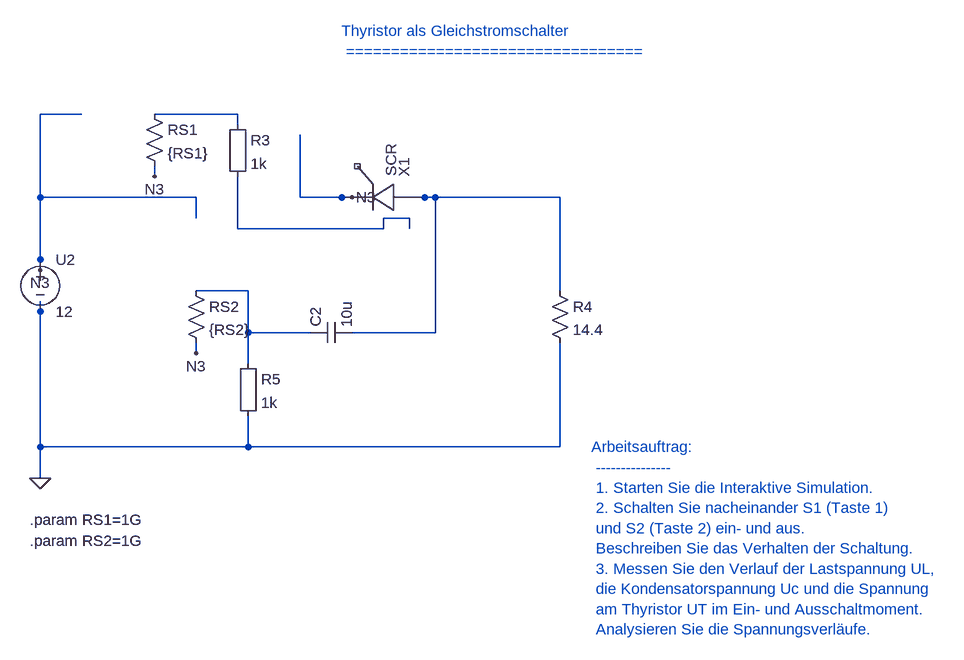
[diagram p0: schematic 11_1_2_Thyristor_als_Gleichstromschalter_2.asc]
11_1_2_Thyristor_als_Gleichstromschalter_2.asc, the LTspice schematic file:
Version 4
SHEET 1 880 680
WIRE 80 464 80 448
WIRE 880 512 880 528
WIRE 560 496 576 496
WIRE 648 336 648 320
WIRE 648 320 608 320
WIRE 672 288 640 288
WIRE 80 720 80 672
WIRE 80 672 80 448
WIRE 80 384 80 288
WIRE 80 288 320 288
WIRE 144 160 80 160
WIRE 80 160 80 288
WIRE 256 160 384 160
WIRE 384 160 384 176
WIRE 320 320 320 288
WIRE 880 528 880 672
WIRE 880 672 400 672
WIRE 496 496 400 496
WIRE 400 672 80 672
WIRE 400 624 400 672
WIRE 400 496 400 544
WIRE 320 432 400 432
WIRE 400 432 400 496
WIRE 880 432 880 288
WIRE 880 288 688 288
WIRE 688 288 688 496
WIRE 688 496 576 496
WIRE 640 288 688 288
WIRE 480 288 480 192
WIRE 544 288 480 288
WIRE 384 256 384 336
WIRE 384 336 608 336
WIRE 608 336 608 320
WIRE 320 512 320 528
WIRE 80 384 80 400
WIRE 256 240 256 256
WIRE 544 288 560 288
FLAG 80 720 0
FLAG 320 528 N3
FLAG 80 400 N3
FLAG 256 256 N3
FLAG 560 288 N3
SYMBOL voltage 80 368 R0
SYMATTR InstName U2
SYMATTR Value 12
SYMBOL Misc\EuropeanResistor 368 160 R0
SYMATTR InstName R3
SYMATTR Value 1k
SYMBOL res 240 144 R0
SYMATTR InstName RS1
SYMATTR Value {RS1}
SYMBOL res 864 416 R0
SYMATTR InstName R4
SYMATTR Value 14.4
SYMBOL Misc\EuropeanResistor 384 528 R0
SYMATTR InstName R5
SYMATTR Value 1k
SYMBOL res 304 416 R0
SYMATTR InstName RS2
SYMATTR Value {RS2}
SYMBOL cap 496 512 R270
SYMATTR InstName C2
SYMATTR Value 10u
SYMBOL SCR 608 288 M270
SYMATTR InstName X1
SYMATTR Prefix X
SYMATTR SpiceModel SCR
TEXT 64 784 Left 2 !.param RS1=1G
TEXT 64 816 Left 2 !.param RS2=1G
TEXT 544 32 Left 2 ;Thyristor als Gleichstromschalter \n =================================
TEXT 928 672 Left 2 ;Arbeitsauftrag: \n --------------- \n 1. Starten Sie die Interaktive Simulation. \n 2. Schalten Sie nacheinander S1 (Taste 1) \n und S2 (Taste 2) ein- und aus. \n Beschreiben Sie das Verhalten der Schaltung. \n 3. Messen Sie den Verlauf der Lastspannung UL, \n die Kondensatorspannung Uc und die Spannung \n am Thyristor UT im Ein- und Ausschaltmoment. \n Analysieren Sie die Spannungsverläufe.

The netlist it stands for:
* 11_1_2_Thyristor_als_Gleichstromschalter_2.asc
V§U2 N3 0 12
R3 N003 N002 1k
RS1 N003 N3 {RS1}
R4 N001 0 14.4
R5 N004 0 1k
RS2 N004 N3 {RS2}
C2 N004 N001 10u
XX1 N001 NC_01 N3 SCR SCR  ; pins A G K
.param RS1=1G
.param RS2=1G
* Thyristor als Gleichstromschalter
*  =================================
* Arbeitsauftrag:
*  ---------------
*  1. Starten Sie die Interaktive Simulation.
*  2. Schalten Sie nacheinander S1 (Taste 1)
*  und S2 (Taste 2) ein- und aus.
*  Beschreiben Sie das Verhalten der Schaltung.
*  3. Messen Sie den Verlauf der Lastspannung UL,
*  die Kondensatorspannung Uc und die Spannung
*  am Thyristor UT im Ein- und Ausschaltmoment.
*  Analysieren Sie die Spannungsverläufe.
.backanno
.end